# EasyEDA Pro project Temp_Con_V116.eprj, schematic TC_485

## Sheets
1 TC-Sense: Board Name: TEMP_TC_485; Create Date: 2025-01-28; Page Name: TC-Sense; Project Name: Temp_Con_V116; Schematic Name: TC_485; Update Date: 2025-01-28; Company: EasyEDA.com; Page Size: A4; Version: V1.0
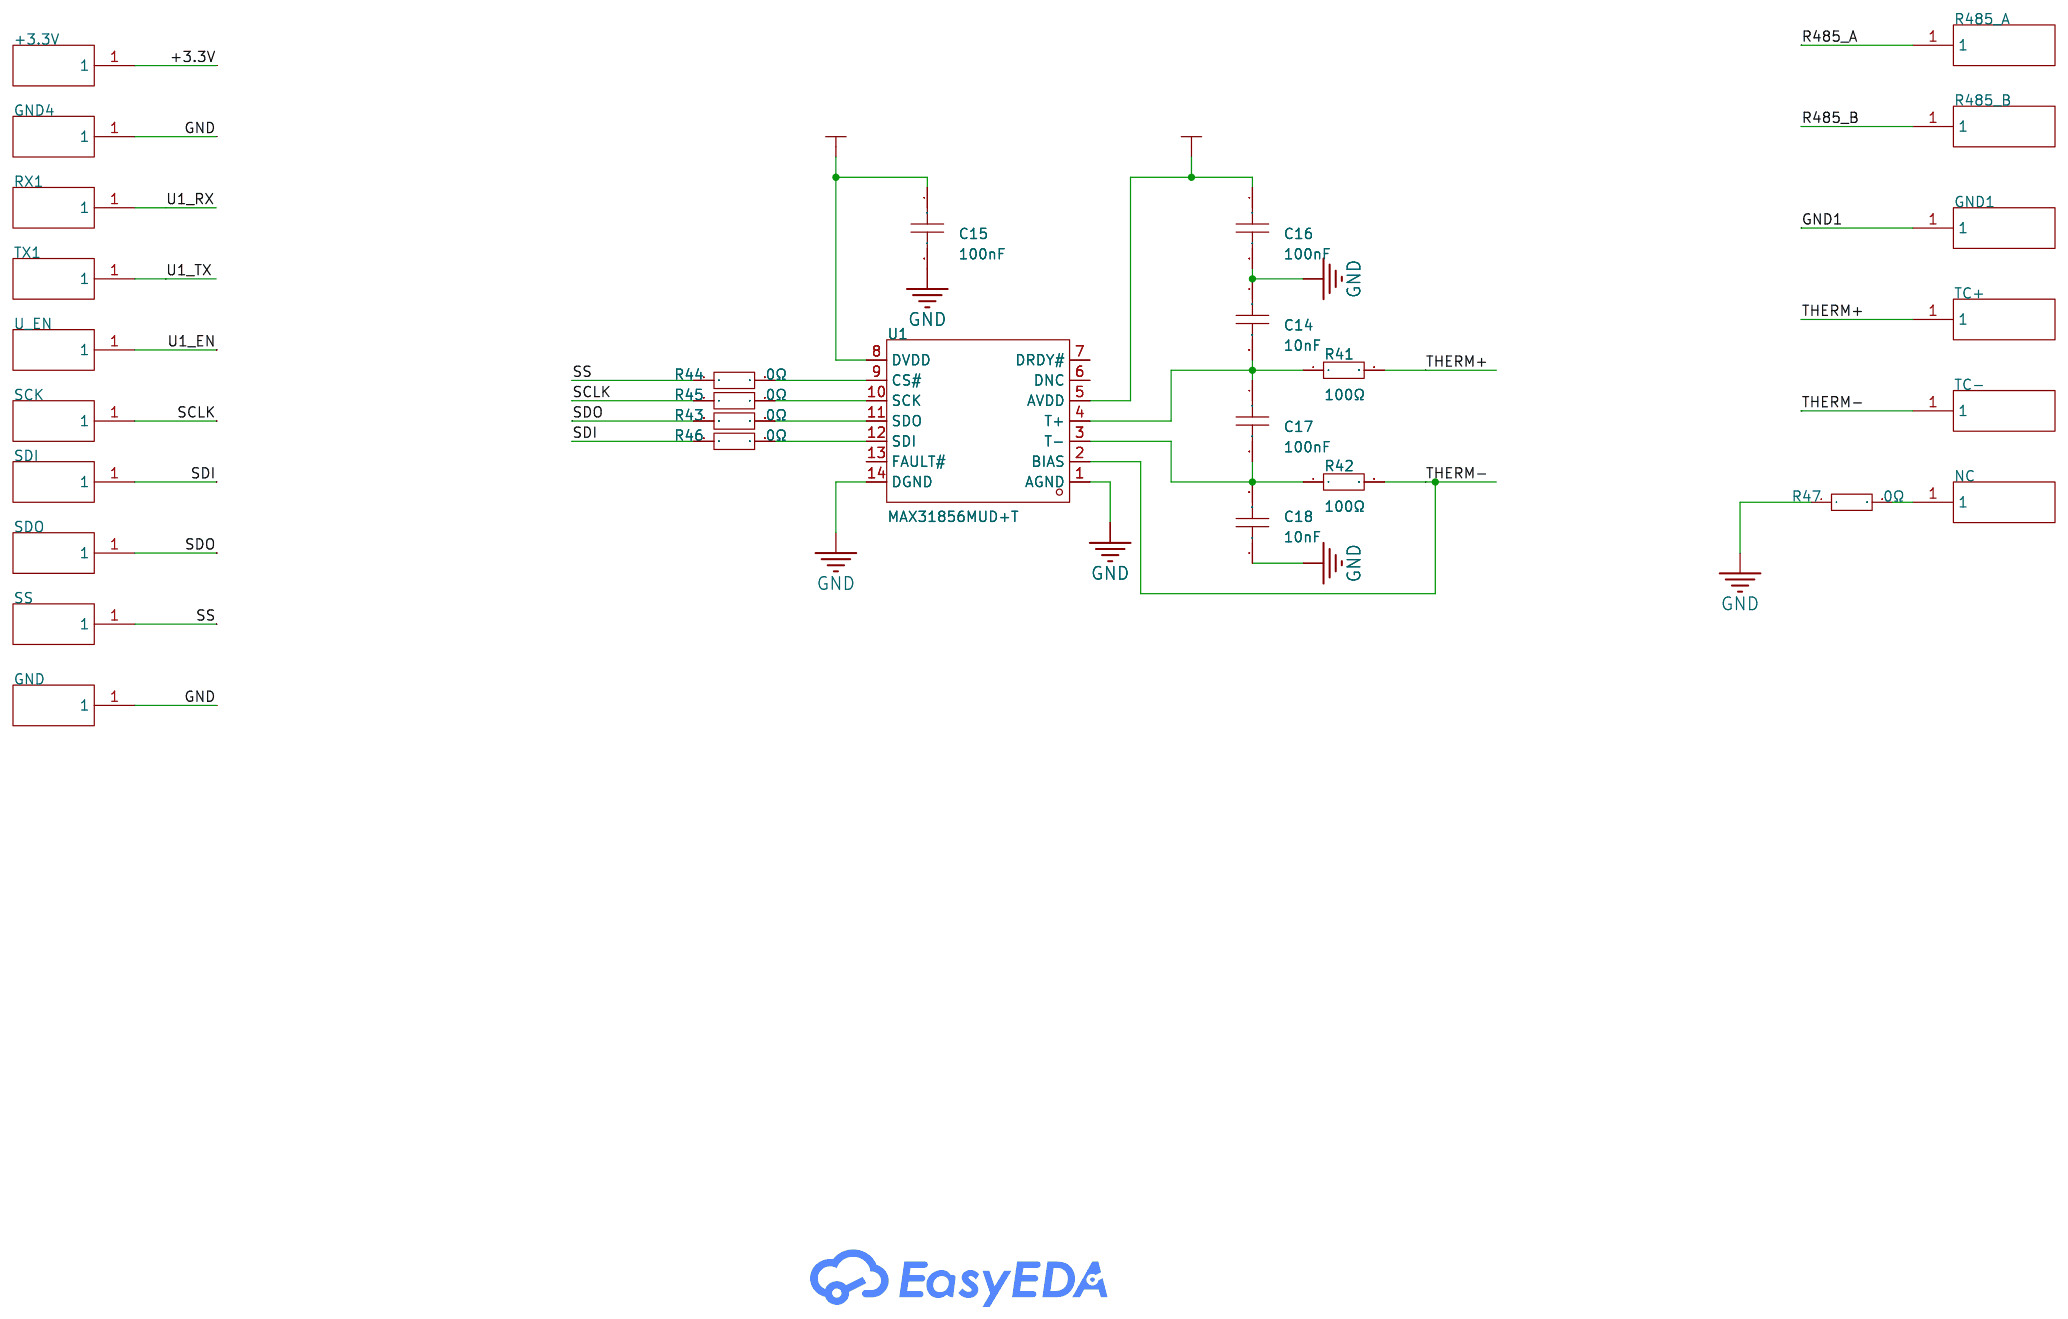
[diagram p4: TC-Sense]
2 RS485: Board Name: TEMP_PT_485; Create Date: 2025-01-22; Page Name: RS485; Schematic Name: SENS_485
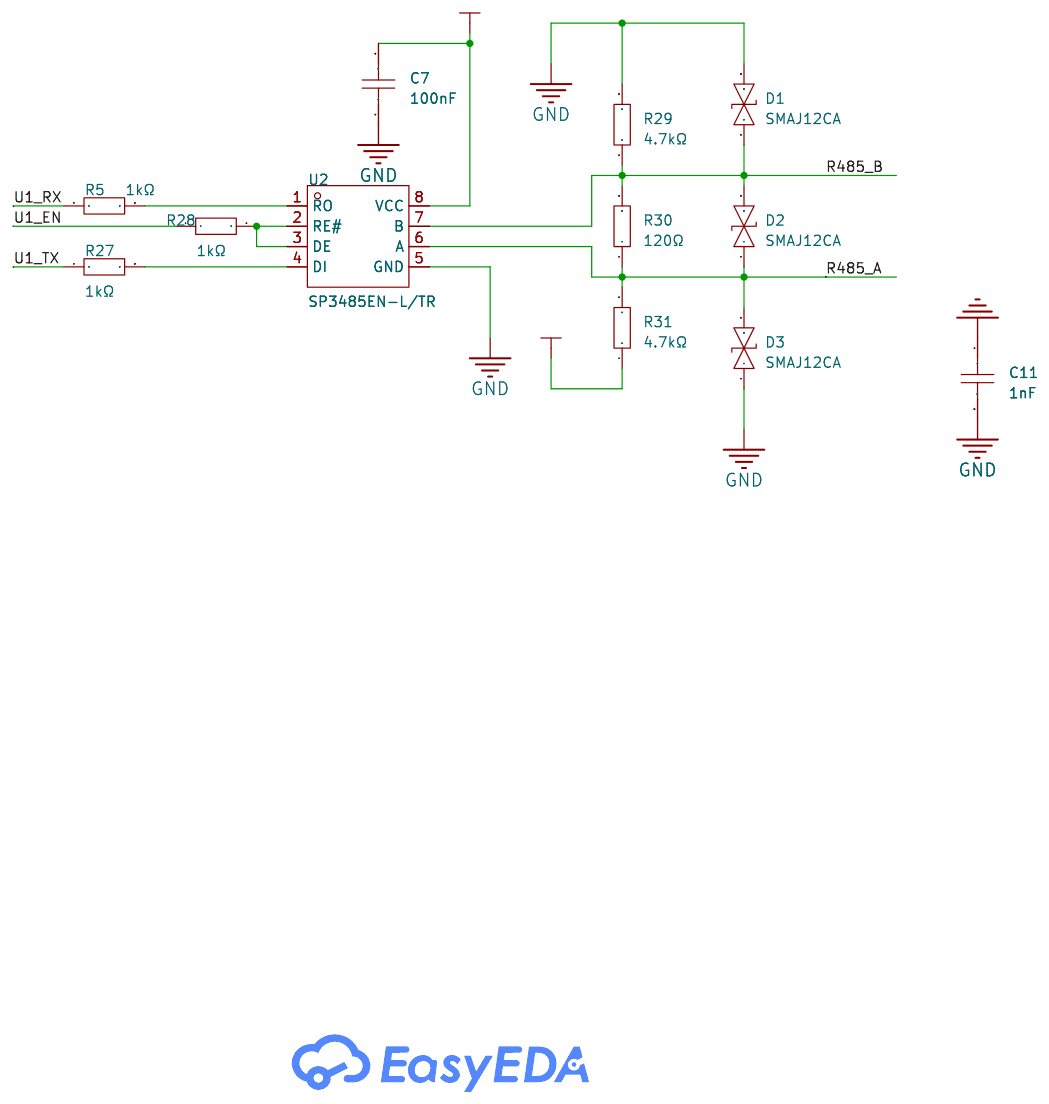
[diagram p5: RS485]

## Parts
sheet RS485
C7  100nF  [C0805]
C11  1nF  [C0805]
D1  SMAJ12CA  [SMA_L4.4-W2.6-LS5.0-BI]
D2  SMAJ12CA  [SMA_L4.4-W2.6-LS5.0-BI]
D3  SMAJ12CA  [SMA_L4.4-W2.6-LS5.0-BI]
R5  1kΩ  [R0805]
R27  1kΩ  [R0805]
R28  1kΩ  [R0805]
R29  4.7kΩ  [R0805]
R30  120Ω  [R0805]
R31  4.7kΩ  [R0805]
U2  SP3485EN-L/TR  [SOIC-8_L5.0-W4.0-P1.27-LS6.0-BL]
sheet TC-Sense
+3.3V  -  [S_FT]  (no BOM)
C14  10nF  [C0805]
C15  100nF  [C0805]
C16  100nF  [C0805]
C17  100nF  [C0805]
C18  10nF  [C0805]
GND  -  [S_FT]  (no BOM)
GND1  -  [B_FT]  (no BOM)
GND4  -  [S_FT]  (no BOM)
NC  -  [B_FT]  (no BOM)
R41  100Ω  [R0805]
R42  100Ω  [R0805]
R43  0Ω  [R0805]
R44  0Ω  [R0805]
R45  0Ω  [R0805]
R46  0Ω  [R0805]
R47  0Ω  [R0805]  (no BOM)
R485_A  -  [B_FT]  (no BOM)
R485_B  -  [B_FT]  (no BOM)
RX1  -  [S_FT]  (no BOM)
SCK  -  [S_FT]  (no BOM)
SDI  -  [S_FT]  (no BOM)
SDO  -  [S_FT]  (no BOM)
SS  -  [S_FT]  (no BOM)
TC+  -  [B_FT]  (no BOM)
TC-  -  [B_FT]  (no BOM)
TX1  -  [S_FT]  (no BOM)
U1  MAX31856MUD+T  [TSSOP-14_L5.0-W4.4-P0.65-LS6.4-BL]
U_EN  -  [S_FT]  (no BOM)

## Library data of the parts
C7 = CC0805KRX7R9BB104: LCSC Part Name: 100nF ±10% 50V; Supplier Part: C49678; Manufacturer: YAGEO(国巨); Supplier Footprint: 0805; JLCPCB Part Class: Basic Part; Datasheet: https://atta.szlcsc.com/upload/public/pdf/source/20180224/C181747_15194369449651363981.pdf; Supplier: LCSC; Tolerance: ±10%; Check: true
C11 = 0805B102K102CT: LCSC Part Name: 1nF ±10% 1kV; Supplier Part: C303890; Manufacturer: Walsin(华新科); Supplier Footprint: 0805; JLCPCB Part Class: Extended Part; Supplier: LCSC; Tolerance: ±10%
D1-D3 = SMAJ12CA_C152122: LCSC Part Name: 双向TVS 12V截止 20.1A峰值脉冲; Supplier Part: C152122; Manufacturer: BORN(伯恩半导体); Supplier Footprint: SMA(DO-214AC); JLCPCB Part Class: Extended Part; Datasheet: https://atta.szlcsc.com/upload/public/pdf/source/20190327/C152114_59D196591C1FC858E9F4FB19F8EA1A29.pdf; Supplier: LCSC; Reverse Stand-Off Voltage (Vrwm): 12V; Maximum Clamping Voltage: 19.9V; Peak Pulse Current (Ipp): 20.1A; Breakdown Voltage: 13.3V; Type: TVS; Check: true
R5 R27 R28 = RC0805FR-071KL: LCSC Part Name: 厚膜电阻 1kΩ ±1% 125mW; Supplier Part: C95781; Manufacturer: YAGEO(国巨); Supplier Footprint: 0805; JLCPCB Part Class: Extended Part; Datasheet: https://atta.szlcsc.com/upload/public/pdf/source/20170708/1499509500945.pdf; Supplier: LCSC; Type: Thick Film Resistors; Tolerance: ±1%; Temperature Coefficient: ±100ppm/℃; Operating Temperature Range: -55℃~+155℃; Check: true
R29 R31 = RC0805FR-074K7L: LCSC Part Name: 厚膜电阻 4.7kΩ ±1% 125mW; Supplier Part: C60816; Manufacturer: YAGEO(国巨); Supplier Footprint: 0805; JLCPCB Part Class: Extended Part; Datasheet: https://atta.szlcsc.com/upload/public/pdf/source/20180904/C276339_014E484F1DBA106FB92D45EABD5A1AC1.pdf; Supplier: LCSC; Type: Thick Film Resistors; Tolerance: ±1%; Temperature Coefficient: ±100ppm/℃; Operating Temperature Range: -55℃~+155℃; Check: true
R30 = RC0805FR-07120RL: LCSC Part Name: 厚膜电阻 120Ω ±1% 125mW; Supplier Part: C114245; Manufacturer: YAGEO(国巨); Supplier Footprint: 0805; JLCPCB Part Class: Extended Part; Datasheet: https://atta.szlcsc.com/upload/public/pdf/source/20180821/C275644_0D56F95EFF785E7D9A1FEF436B37DA78.pdf; Supplier: LCSC; Type: Thick Film Resistors; Tolerance: ±1%; Temperature Coefficient: ±100ppm/℃; Operating Temperature Range: -55℃~+155℃; Check: true
U2 = SP3485EN-L/TR: LCSC Part Name: SP3485 +3.3V低功耗半双工RS-485收发器，数据速率10Mbps; Supplier Part: C8963; Manufacturer: MaxLinear(迈凌); Supplier Footprint: SOIC-8; JLCPCB Part Class: Basic Part; Datasheet: https://atta.szlcsc.com/upload/public/pdf/source/20170601/1496285796963.pdf; Supplier: LCSC; Types: Transceiver; Number of Driver: 1; Number of receiver: 1; Supply Voltage: 3.3V; Data Rate: 10Mbps; Operating Temperature: -40℃~+85℃; Check: true
+3.3V GND GND4 RX1 SCK SDI SDO SS TX1 U_EN = S_TM
C14 C18 = CC0805KRX7R9BB103: LCSC Part Name: 10nF ±10% 50V; Supplier Part: C83170; Manufacturer: YAGEO(国巨); Supplier Footprint: 0805; JLCPCB Part Class: Extended Part; Datasheet: https://atta.szlcsc.com/upload/public/pdf/source/20170211/1486785656773.pdf; Supplier: LCSC; Tolerance: ±10%
C15-C17 = CC0805KRX7R9BB104: LCSC Part Name: 100nF ±10% 50V; Supplier Part: C49678; Manufacturer: YAGEO(国巨); Supplier Footprint: 0805; JLCPCB Part Class: Basic Part; Datasheet: https://atta.szlcsc.com/upload/public/pdf/source/20180224/C181747_15194369449651363981.pdf; Supplier: LCSC; Tolerance: ±10%
GND1 NC R485_A R485_B TC+ TC- = B_TM
R41 R42 = RC0805FR-07100RL: LCSC Part Name: 厚膜电阻 100Ω ±1% 125mW; Supplier Part: C105577; Manufacturer: YAGEO(国巨); Supplier Footprint: 0805; JLCPCB Part Class: Extended Part; Datasheet: https://atta.szlcsc.com/upload/public/pdf/source/20180904/C276339_014E484F1DBA106FB92D45EABD5A1AC1.pdf; Supplier: LCSC; Type: Thick Film Resistors; Tolerance: ±1%; Temperature Coefficient: ±100ppm/℃; Operating Temperature Range: -55℃~+155℃
R43-R47 = RC0805JR-070RL: LCSC Part Name: 厚膜电阻 0Ω ±5% 125mW; Supplier Part: C96345; Manufacturer: YAGEO(国巨); Supplier Footprint: 0805; JLCPCB Part Class: Extended Part; Datasheet: https://atta.szlcsc.com/upload/public/pdf/source/20170708/1499509500945.pdf; Supplier: LCSC; Type: Thick Film Resistors; Tolerance: ±5%; Operating Temperature Range: -55℃~+155℃
U1 = MAX31856MUD+T: Supplier Part: C2653162; Manufacturer: ADI(亚德诺)/MAXIM(美信); Supplier Footprint: TSSOP-14; JLCPCB Part Class: Extended Part; Datasheet: https://atta.szlcsc.com/upload/public/pdf/source/20180413/C116632_831D9B1C9ECFD227FC0EF5729DAE9663.pdf; Supplier: LCSC

## Nets
+3.3V: +3.3V.1 C7.2 C15.1 C16.1 R31.1 U1.5(AVDD) U1.8(DVDD) U2.8(VCC)
GND: C7.1 C11.2 C14.1 C15.2 C16.2 C18.1 D1.2 D3.1 GND.1 GND4.1 R29.2 R47.1 U1.1(AGND) U1.14(DGND) U2.5(GND)
GND1: C11.1 GND1.1
R485_A: D2.1 D3.2 R30.1 R31.2 R485_A.1 U2.6(A)
R485_B: D1.1 D2.2 R29.1 R30.2 R485_B.1 U2.7(B)
SCLK: R45.1 SCK.1
SDI: R46.1 SDI.1
SDO: R43.1 SDO.1
SS: R44.1 SS.1
THERM+: R41.2 TC+.1
THERM-: R42.2 TC-.1 U1.2(BIAS)
U1_EN: R28.1 U_EN.1
U1_RX: R5.1 RX1.1
U1_TX: R27.1 TX1.1
$2N3925: NC.1 R47.2
$2N8941: C14.2 C17.1 R41.1 U1.4(T+)
$2N8947: C17.2 C18.2 R42.1 U1.3(T-)
$2N8951: R43.2 U1.11(SDO)
$2N8952: R46.2 U1.12(SDI)
$2N8954: R44.2 U1.9(CS#)
$2N8955: R45.2 U1.10(SCK)
$3N638: R5.2 U2.1(RO)
$3N639: R28.2 U2.2(RE#) U2.3(DE)
$3N640: R27.2 U2.4(DI)

Not connected (* = marked no-connect by the designer): U1 6(DNC) 7(DRDY#) 13(FAULT#)
